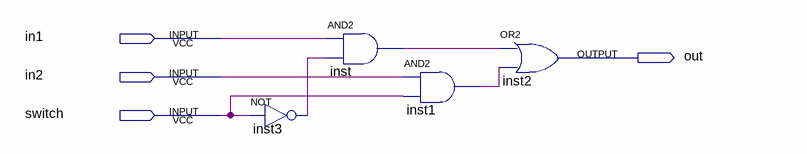
[diagram p0: schematic sheet]
// Quartus schematic switch_1_2.bdf as structural Verilog: 4 symbols, 4 pins
module switch_1_2 (
  input  in1,
  input  in2,
  input  switch,
  output out
);

  wire inst1_out, inst3_out, inst_out;

  not inst3 (inst3_out, switch);
  and inst (inst_out, in1, inst3_out);
  and inst1 (inst1_out, in2, switch);
  or inst2 (out, inst_out, inst1_out);
endmodule
